# EAGLE design gwx-3p-control-oc (EAGLE 7.7.0)
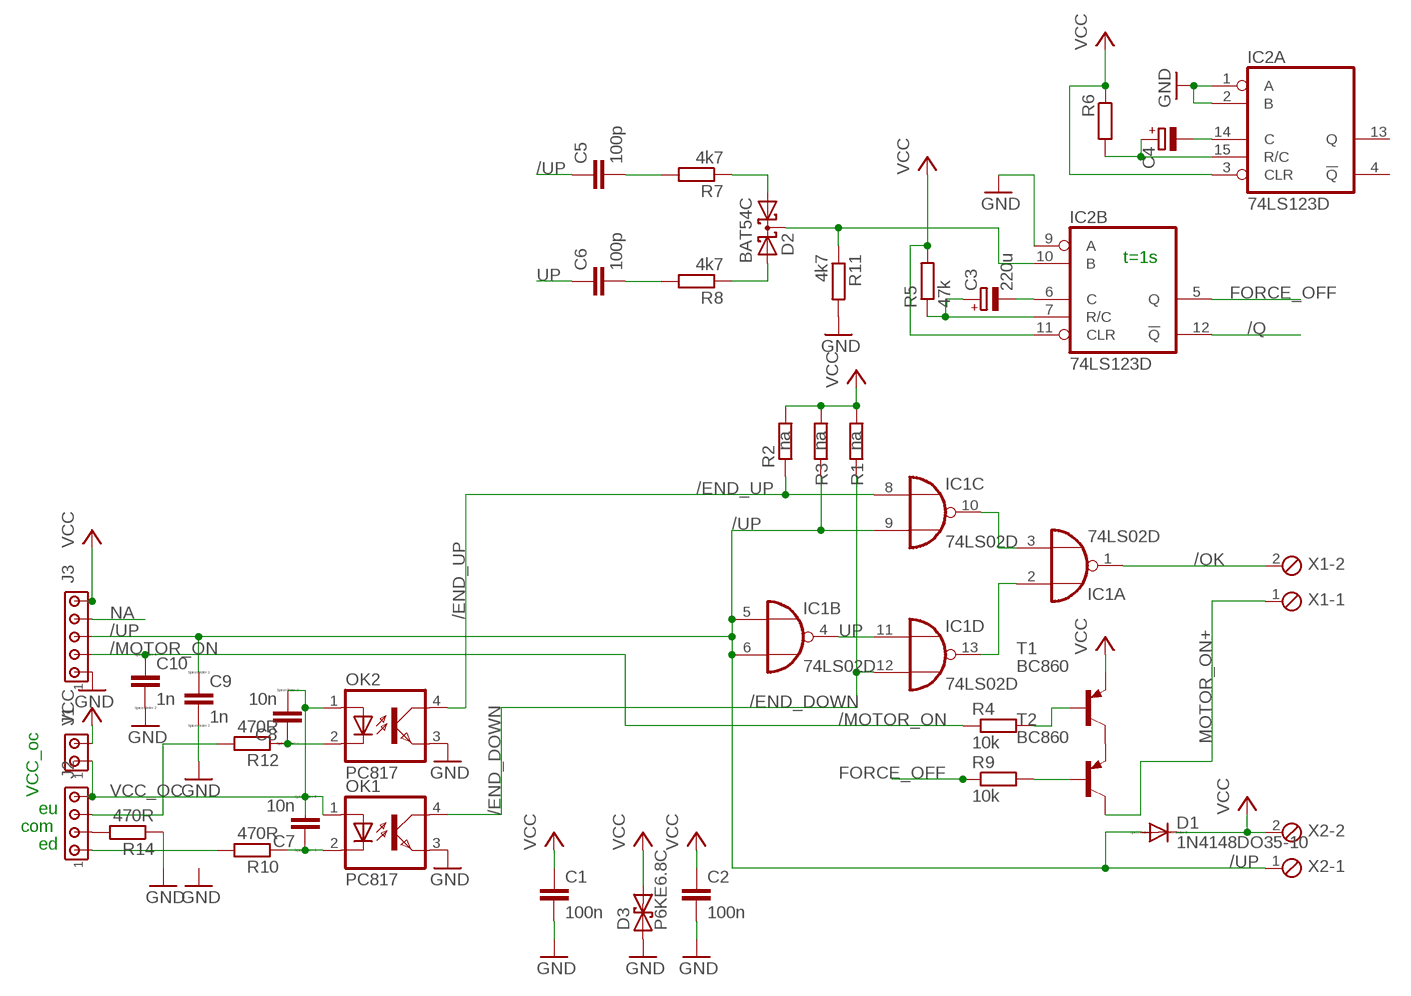
[diagram p0: schematic, sheet 1]

## Parts
C1  100n  C-EUC0603K  [C0603K]
C2  100n  C-EUC0603K  [C0603K]
C3  220u  CPOL-EUE5-6  [E5-6]
C4  CPOL-EUE5-6  [E5-6]
C5  100p  C-EUC0603K  [C0603K]
C6  100p  C-EUC0603K  [C0603K]
C7  10n  CC0603  [C0603]
C8  10n  CC0603  [C0603]
C9  1n  CC0603  [C0603]
C10  1n  CC0603  [C0603]
D1  1N4148DO35-10  [DO35-10]
D2  BAT54C  [SOT23]
D3  P6KE6.8C  P6KEXXC  [CB417-15]
IC1  74LS02D  [SO14]
IC2  74LS123D  [SO16]
J1  MTA02-100  [10X02MTA]
J2  MTA04-100  [10X04MTA]
J3  MTA05-100  [10X05MTA]
OK1  PC817  [DIL04]
OK2  PC817  [DIL04]
R1  na  R-EU_R0603  [R0603]
R2  na  R-EU_R0603  [R0603]
R3  na  R-EU_R0603  [R0603]
R4  10k  R-EU_R0603  [R0603]
R5  47k  R-EU_R0603  [R0603]
R6  R-EU_R0603  [R0603]
R7  4k7  R-EU_R0603  [R0603]
R8  4k7  R-EU_R0603  [R0603]
R9  10k  R-EU_R0603  [R0603]
R10  470R  R-EU_R0603  [R0603]
R11  4k7  R-EU_R0603  [R0603]
R12  470R  R-EU_R0603  [R0603]
R14  470R  R-EU_R0603  [R0603]
T1  BC860  BC856B-PNP-SOT23-BEC  [SOT23-BEC]
T2  BC860  BC856B-PNP-SOT23-BEC  [SOT23-BEC]
X1  MPT2  [2POL254]
X2  MPT2  [2POL254]

## Nets
/ED: J2.1 R10.2
/END_DOWN: IC1.12(D:I1) OK1.4(COL) R1.1
/END_UP: IC1.8(C:I0) OK2.4(COL) R2.1
/EU: J2.3 R12.2
/MOTOR_ON: C10.1 J3.2 R4.1
/OK: IC1.1(A:O) X1.2
/Q: IC2.12(B:!Q)
/UP: C5.1 C9.1 D1.A IC1.5(B:I0) IC1.6(B:I1) IC1.9(C:I1) J3.3 R3.1 X2.1
ECOM: J2.2 R14.2
FORCE_OFF: IC2.5(B:Q) R9.1
GND: C1.2 C2.2 C9.2 C10.2 D3.A IC2.1(A:A) IC2.2(A:B) IC2.9(B:A) J3.1 OK1.3(EMIT) OK2.3(EMIT) R11.2 R14.1
MOTOR_ON+: T2.C X1.1
N$1: C3.+ IC2.7(B:R/C) R5.1
N$2: C3.- IC2.6(B:C)
N$3: C4.+ IC2.15(A:R/C) R6.2
N$4: C5.2 R7.2
N$5: IC1.3(A:I1) IC1.10(C:O)
N$6: IC1.2(A:I0) IC1.13(D:O)
N$7: C6.2 R8.2
N$8: D2.3(CC) IC2.10(B:B) R11.1
N$9: C4.- IC2.14(A:C)
N$10: R4.2 T1.B
N$11: R9.2 T2.B
N$12: T1.C T2.E
N$13: D2.1(A1) R7.1
N$14: C7.1 OK1.2(C) R10.1
N$15: C8.1 OK2.2(C) R12.1
N$16: D2.2(A2) R8.1
UP: C6.1 IC1.4(B:O) IC1.11(D:I0)
VCC: C1.1 C2.1 D1.C D3.C IC2.3(A:CLR) IC2.11(B:CLR) J1.2 J3.5 R1.2 R2.2 R3.2 R5.2 R6.1 T1.E X2.2
VCC_OC: C7.2 C8.2 J1.1 J2.4 OK1.1(A) OK2.1(A)
Unconnected: IC2.4(A:!Q) IC2.13(A:Q) J3.4

## Notes on the sheet
- t=1s
- VCC_oc
- eu
- com
- ed

## Power pins joined to a net without a drawn wire
GND: IC1.7(P:GND) IC2.8(P:GND)
VCC: IC1.14(P:VCC) IC2.16(P:VCC)

## Library data of the parts
C1 C2 C5 C6 = rcl:C-EU: CAPACITOR, European symbol
C3 C4 = rcl:CPOL-EU: POLARIZED CAPACITOR, European symbol
C7-C10 = eagle-ltspice:C: CAPACITOR, European symbol; SPICEMODEL: NONE; SPICEPREFIX: C
D1 = diode:1N4148: DIODE high speed (Philips)
D2 = diode:BAT54C: Schottky Diodes Source: Fairchild .. BAT54.pdf
D3 = diode:P6KEXXC: DIODE transient-voltage suppressor
IC1 = 74xx-eu:74*02: Quad 2-input NOR gate
IC2 = 74xx-eu:74*123: Retriggerable monostable MULTIVIBRATOR
J1 = con-amp:MTA02-100: AMP connector
J2 = con-amp:MTA04-100: AMP connector
J3 = con-amp:MTA05-100: AMP connector
OK1 OK2 = optocoupler:PC817: SHARP OPTO COUPLER; MPN: PC817X4J000F; OC_FARNELL: 9707727; OC_NEWARK: 97K7059
R1-R4 R9 = resistor:R-EU_: RESISTOR, European symbol
R5-R8 R10-R12 R14 = rcl:R-EU_: RESISTOR, European symbol
T1 T2 = transistor:*-PNP-: PNP Transistror
X1 X2 = con-phoenix-254:MPT2: PHOENIX CONNECTOR; OC_FARNELL: unknown; OC_NEWARK: unknown

## Board
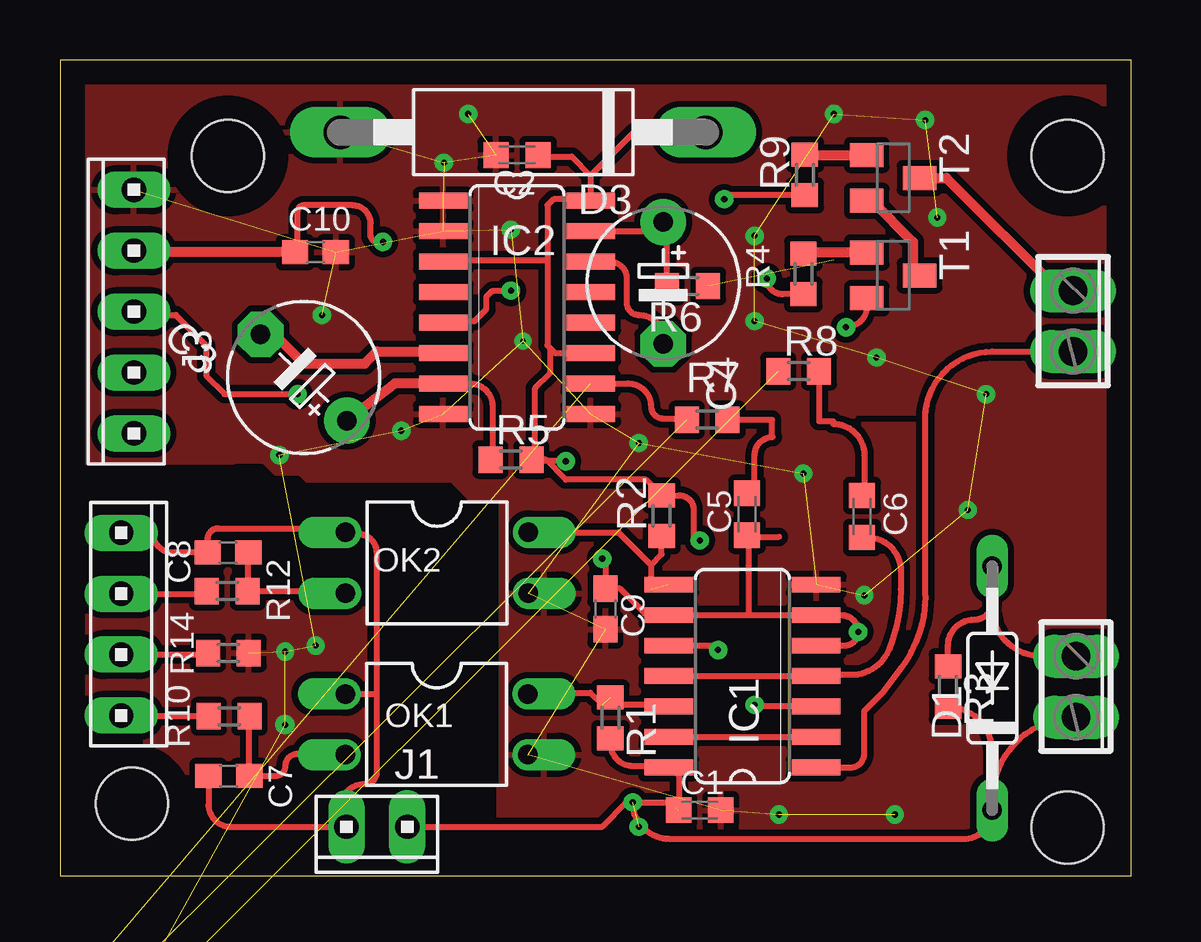
[diagram p1: board, top side]
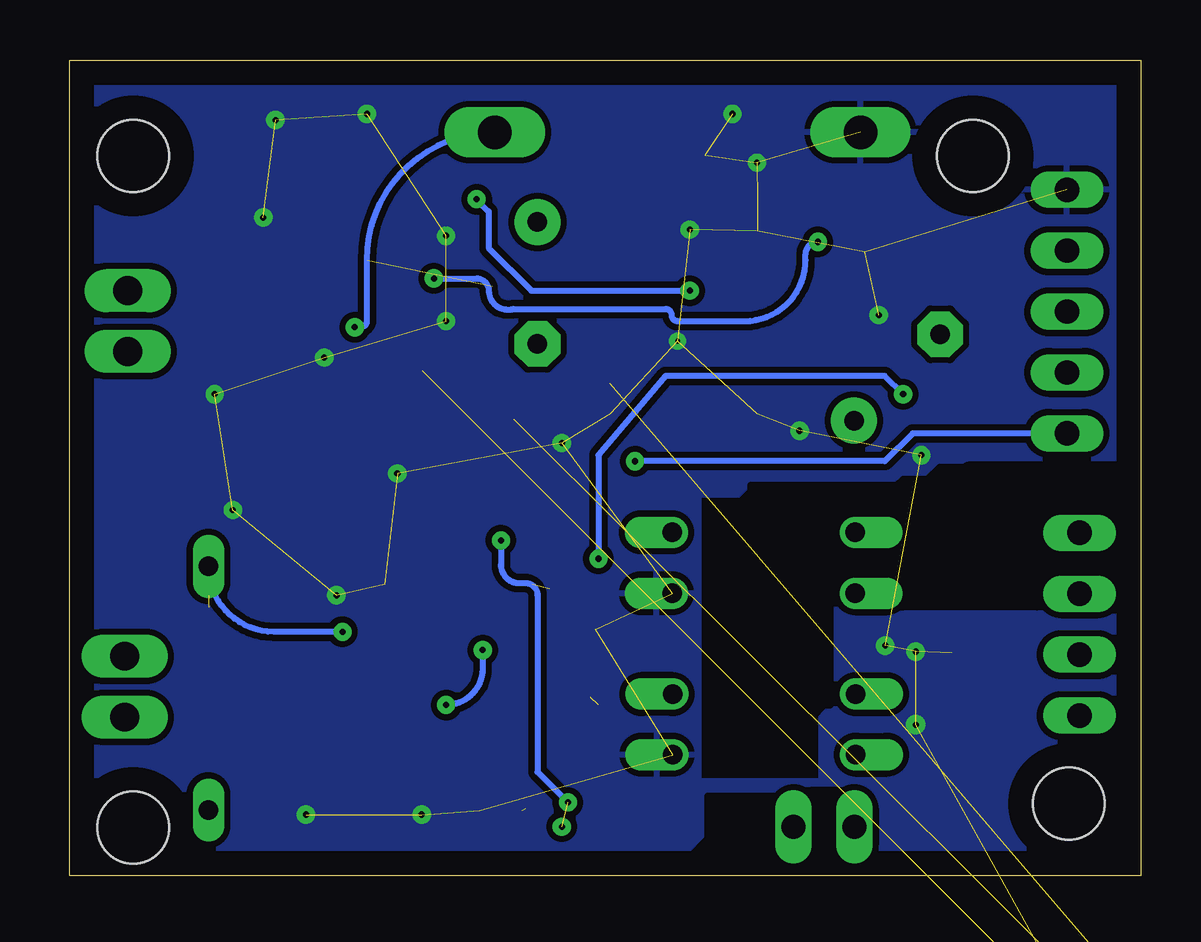
[diagram p2: board, bottom side, seen from below]

Size 44.65 x 34 mm. Coordinates in mm from the lower left corner, seen from the top.
Outline: 0,0 44.65,0 44.65,34 0,34 0,0
Copper layers (1*16): Top 0.035mm / dielectric 1.5mm / Bottom 0.035mm
Design rules "10mil *": minimum track width 10mil, minimum drill 10mil, track to track 10mil, track to pad 10mil, pad to pad 10mil, via to via 10mil, smd to smd 8mil, copper to edge 40mil, drill to drill 10mil, minimum pad ring 10mil, minimum via ring 10mil, stop-mask expansion 4mil, vias tented up to drill 0mil, thermal gap 10mil
Holes 3 mm at 7,30 3,3 42,30 42,2
tKeepout: 3 lines
bKeepout: 1 lines
tRestrict: area 13.5,3.8 to 18.3,15.5; 12 lines
bRestrict: area 13.5,4.1 to 18.3,15.7; 30 lines

### Footprints (pad centres in the part's own frame; a part is rotated, then mirrored left to right if it is on the bottom)
C0603K = smd 1.05 x 1.08: 1 -0.875,0; 2 0.875,0
E5-6 = drill 0.813 pad 1.905: + -2.54,0 | drill 0.813 pad 1.905 octagon: - 2.54,0
C0603 = smd 1.1 x 1: 1 -0.85,0; 2 0.85,0
DO35-10 = drill 0.813 long: A 5.08,0; C -5.08,0
SOT23 = smd 1 x 1.4: 1 -0.95,-1.1; 2 0.95,-1.1; 3 0,1.1
CB417-15 = drill 1.397 long: A 7.62,0; C -7.62,0
SO14 = smd 0.66 x 2.032: 1 -3.81,-3.073; 2 -2.54,-3.073; 3 -1.27,-3.073; 4 0,-3.073; 5 1.27,-3.073; 6 2.54,-3.073; 7 3.81,-3.073; 8 3.81,3.073; 9 2.54,3.073; 10 1.27,3.073; 11 0,3.073; 12 -1.27,3.073; 13 -2.54,3.073; 14 -3.81,3.073
SO16 = smd 0.66 x 2.032: 1 -4.445,-3.073; 2 -3.175,-3.073; 3 -1.905,-3.073; 4 -0.635,-3.073; 5 0.635,-3.073; 6 1.905,-3.073; 7 3.175,-3.073; 8 4.445,-3.073; 9 4.445,3.073; 10 3.175,3.073; 11 1.905,3.073; 12 0.635,3.073; 13 -0.635,3.073; 14 -1.905,3.073; 15 -3.175,3.073; 16 -4.445,3.073
10X02MTA = drill 1.016 long: 1 1.27,0; 2 -1.27,0
10X04MTA = drill 1.016 long: 1 3.81,0; 2 1.27,0; 3 -1.27,0; 4 -3.81,0
10X05MTA = drill 1.016 long: 1 5.08,0; 2 2.54,0; 3 0,0; 4 -2.54,0; 5 -5.08,0
DIL04 = drill 0.813 offset: 1 -1.27,-3.81; 2 1.27,-3.81; 3 1.27,3.81; 4 -1.27,3.81
R0603 = smd 1 x 1.1: 1 -0.85,0; 2 0.85,0
SOT23-BEC = smd 1 x 1.4: B -0.95,-1.1; C 0,1.1; E 0.95,-1.1
2POL254 = drill 1.2 long: 1 -1.27,0; 2 1.27,0

### Placement (x,y rotation side)
C1  26.67,2.73 0 top
C2  19.05,30.04 180 top
C3  10.16,20.76 135 top
C4  25.15,24.7 270 top
C5  28.64,15.07 90 top
C6  33.43,14.97 90 top
C7  7.04,4.15 180 top
C8  7.01,13.47 180 top
C9  22.73,11.12 270 top
C10  10.65,25.98 0 top
D1  38.86,7.81 90 top
D2  -2.54,-9.4 0 top  (outside the outline)
D3  19.3,30.99 180 top
IC1  28.45,8.32 90 top
IC2  19.05,23.69 270 top
J1  13.21,2.03 180 top
J2  2.55,10.48 270 top
J3  3.08,23.51 90 top
OK1  15.7,6.3 270 top
OK2  15.71,13.04 270 top
R1  22.94,6.57 270 top
R2  25.08,15 90 top
R3  37.02,7.87 270 top
R4  30.99,25.08 90 top
R5  18.8,17.34 0 top
R6  26.16,24.57 180 top
R7  26.98,19 0 top
R8  30.79,21.03 0 top
R9  31.05,29.21 90 top
R10  7.05,6.64 180 top
R11  -3.56,-15.49 0 top  (outside the outline)
R12  6.97,11.86 180 top
R14  7.02,9.28 180 top
T1  34.73,25.02 270 top
T2  34.73,29.08 270 top
X1  42.23,23.11 270 top
X2  42.35,7.87 270 top

### Tracks (layer width: path | path; a pad name or v marks a point on that pad's centre or on a via)
/ED
  Top 0.254: R10.2 2.58,6.64 J2.1
/END_DOWN  (1 unrouted)
  Top 0.254: IC1.12 25.31,7.11 22.61,7.11 22.1,7.62 19.56,7.62 OK1.4
/END_UP  (1 unrouted)
  Top 0.254: OK2.4 23.29,14.31 24.64,12.95 | 24.64,12.95 24.64,11.94 | 24.64,12.95 25.08,13.4 R2.1
/EU
  Top 0.254: J2.3 6.01,11.75 R12.2
/MOTOR_ON  (via drill 0.25)
  Top 0.254: R4.1 30.13,24.23 arc-90 v29.46,24.89 | v13.46,26.42 13.21,26.42 arc-90 12.95,26.67 12.95,27.18 arc90 12.19,27.94 10.16,27.94 arc90 9.91,27.69 9.91,26.09
  Top 0.406: J3.2 3.15,25.98 C10.1 9.91,26.09
  Bottom 0.254: v29.46,24.89 27.69,24.89 arc90 27.18,24.38 arc-106 26.16,23.62 19.81,23.62 arc90 19.56,23.37 arc-90 19.3,23.11 16.51,23.11 arc-90 13.97,25.65 13.97,25.91 arc90 v13.46,26.42
/OK
  Top 0.254: IC1.1 32.95,4.51 arc90 33.53,5.08 33.53,6.86 34.29,7.62 35.05,8.64 arc37 36.07,11.68 36.07,19.05 arc-90 38.86,21.84 X1.2
/UP  (via drill 0.25)  (1 unrouted)
  Top 0.254: 28.7,10.86 IC1.9 24.38,10.92 23.34,11.96 C9.1 22.73,13.08 v22.61,13.21 | 28.7,10.86 IC1.6 32.58,10.86 arc-90 v33.27,10.16 arc-90 32.7,9.59 IC1.5 32.26,9.4 | J3.3 3.22,23.37 4.83,23.37 6.1,22.1 6.1,20.83 6.86,20.07 v9.91,20.07 | C5.1 28.7,14.12 | 28.7,14.12 28.7,10.86 | R3.1 37.02,9.59 arc-90 38.1,10.67 arc106 38.86,11.68 arc-33 D1.A | X2.1 40.89,9.14 arc-90 38.86,11.18 | 28.7,14.12 29.97,14.12
  Bottom 0.254: v9.91,20.07 10.67,20.83 19.81,20.83 22.61,17.53 v22.61,13.21 | v33.27,10.16 36.13,10.16 arc90 D1.A
ECOM
  Top 0.254: J2.2 6.1,9.21 R14.2
FORCE_OFF  (via drill 0.25)
  Top 0.254: R9.1 27.85,28.36 v27.69,28.19 | IC2.5 16.04,23.11 17.27,23.11 17.78,23.62 17.78,24.13 18.03,24.38 v18.8,24.38
  Bottom 0.254: v27.69,28.19 27.18,27.69 27.18,26.16 25.4,24.38 v18.8,24.38
GND  (via drill 0.2 pad 0.25, 0.25, 0.25 pad 0.25, 0.25 pad 0.81)  (37 unrouted)
  other vias: 9.38,6.29 10.92,23.37 9.14,17.53 9.38,9.33 30.99,16.76 29.97,2.54 34.04,21.59 34.8,2.54 24.13,18.03 14.22,18.54 33.53,11.68 16,29.72 18.8,26.92 37.85,15.24 38.61,20.07 36.07,31.5 36.58,27.43 32.26,31.75 17.02,31.75 10.65,9.59 28.96,23.11 28.96,26.67 19.3,22.29
  pour Bottom: -0.76,34.8 -0.76,-0.51 45.72,-0.51 45.72,34.8 43.94,34.8
  pour Top: -0.51,34.29 46.23,34.29 46.23,-1.52 -1.02,-1.52 -1.02,2.03 -1.02,34.29
MOTOR_ON+
  Top 0.406: T2.C 36.96,29.08 41.66,24.38 X1.1
N$1
  Top 0.254: IC2.7 17.08,20.51 arc-90 18.03,19.56 18.03,17.43 arc-90 R5.1
  Top 0.406: IC2.7 13.96,20.51 C3.+
N$2
  Top 0.406: C3.- 8.94,22.56 10.16,21.34 12.7,21.34 13.21,21.84 15.24,21.84 15.3,21.78 IC2.6
N$3
  Top 0.254: IC2.15 24.77,26.86 C4.+ 25.31,27.08 R6.2
N$4
  Top 0.254: R7.2 29.68,19 29.68,18.29 29.72,18.29 arc90 28.96,17.53 28.96,16.26 arc-90 C5.2
  Top 0.406: 28.64,15.84 C5.2
N$5  (via drill 0.25)
  Top 0.254: IC1.10 27.24,9.59 arc-90 v27.43,9.4 | IC1.3 28.96,7.05 v28.96,7.11
  Bottom 0.254: v27.43,9.4 27.43,8.64 arc90 v28.96,7.11
N$6
  Top 0.254: IC1.13 IC1.2
N$7
  Top 0.254: R8.2 31.64,18.94 32.22,18.94 32.22,18.83 arc-90 33.53,17.53 33.53,15.94 arc-90 C6.2 33.43,15.84
N$8  (2 unrouted)
  Top 0.254: IC2.10 23.68,20.51 arc-90 24.64,19.56 arc90 25.15,19.05 26.08,19.05
N$9
  Top 0.254: IC2.14 22.92,25.59 arc-90 23.62,24.89 23.62,23.88 arc90 24.13,23.37 arc-100 C4.-
N$10
  Top 0.406: T1.B 31.03,25.97 R4.2
N$11
  Top 0.406: R9.2 31.08,30.03 T2.B
N$12
  Top 0.406: T2.E 33.84,28.13 35.56,26.42 35.56,25.29 T1.C
N$13  (1 unrouted)
N$14
  Top 0.254: OK1.2 arc3 9.91,5.08 arc90 9.4,4.57 arc-90 8.98,4.15 C7.1 7.89,6.62 R10.1
N$15
  Top 0.254: R12.1 11.81,11.86 OK2.2 | 7.87,11.91 R12.1 | C8.1 7.82,13.47 R12.1
N$16  (1 unrouted)
UP
  Top 0.254: IC1.11 IC1.4 31.59,8.38 33.27,8.38 arc57 34.54,9.4 arc23 35.05,11.94 35.05,12.7 arc90 33.66,14.1 C6.1 33.43,14.14
VCC  (via drill 0.25)  (3 unrouted)
  Top 0.254: J1.2 22.61,2.03 23.62,3.05 v23.88,3.05 | 20.32,25.65 20.32,27.94 20.57,28.19 22.06,28.19 IC2.16 22.12,29.18 | 20.32,25.65 20.32,22.1 20.45,21.97 | 20.45,21.97 20.64,21.78 IC2.11 | R5.2 19.81,17.5 19.81,20.32 20.45,20.95 20.45,21.97 | IC2.3 16.04,25.65 20.32,25.65 | C2.1 19.99,29.97 21.34,29.97 22.12,29.18 | 22.12,29.18 23.93,30.99 D3.C | R5.2 20.25,17.34 21.08,16.51 24.42,16.51 R2.2 25.8,15.85 arc-90 26.42,15.24 26.42,14.22 arc90 v26.67,13.97 | R1.2 22.94,5.5 arc90 23.88,4.57 25.31,4.57 arc-90 IC1.14 25.56,4.32 25.65,4.32 25.8,4.18 C1.1 25.8,2.4 | v23.88,3.05 25.4,3.05 arc-90 25.65,2.79 | D1.C 38.86,3.11 arc-90 X2.2 | D1.C 38.86,5.18 arc90 R3.2 | D1.C arc-90 37.66,1.52 25.4,1.52 arc-90 v23.88,3.05 | T1.E 33.63,23.73 arc-90 v32.77,22.86 | v21.08,17.27 19.71,17.27 R5.2
  Bottom 0.254: v26.67,13.97 26.67,12.95 arc-90 25.91,12.19 25.65,12.19 arc90 25.15,11.68 25.15,4.32 v23.88,3.05 | v32.77,22.86 32.51,22.86 arc-90 32.26,23.11 32.26,25.65 arc90 D3.C | J3.5 9.51,18.43 10.67,17.27 v21.08,17.27
  other vias: 24.13,2.03
VCC_OC
  Top 0.254: C7.2 6.19,2.96 arc90 7.11,2.03 J1.1 | J2.4 3.88,14.29 arc90 4.7,13.46 6.15,13.46 arc90 C8.2 6.16,14.03 arc-90 6.6,14.48 10.16,14.48 arc-90 10.41,14.22 11.82,14.22 | OK2.1 11.82,14.22 | 11.82,14.22 12.45,14.22 arc-90 13.21,13.46 13.21,7.62 | 13.21,7.62 13.21,4.32 arc-90 12.7,3.81 arc134 J1.1 | 12.45,3.05 12.45,2.54 J1.1 | OK1.1 13.16,7.57 arc90 13.21,7.62

### Text on the board
tStop: G | /M | + | Mot | /U | na | - | 5 | + | GwxHaus / Control2 | Rev3 | 5 | Rel / up | - | eu | com | ed | +